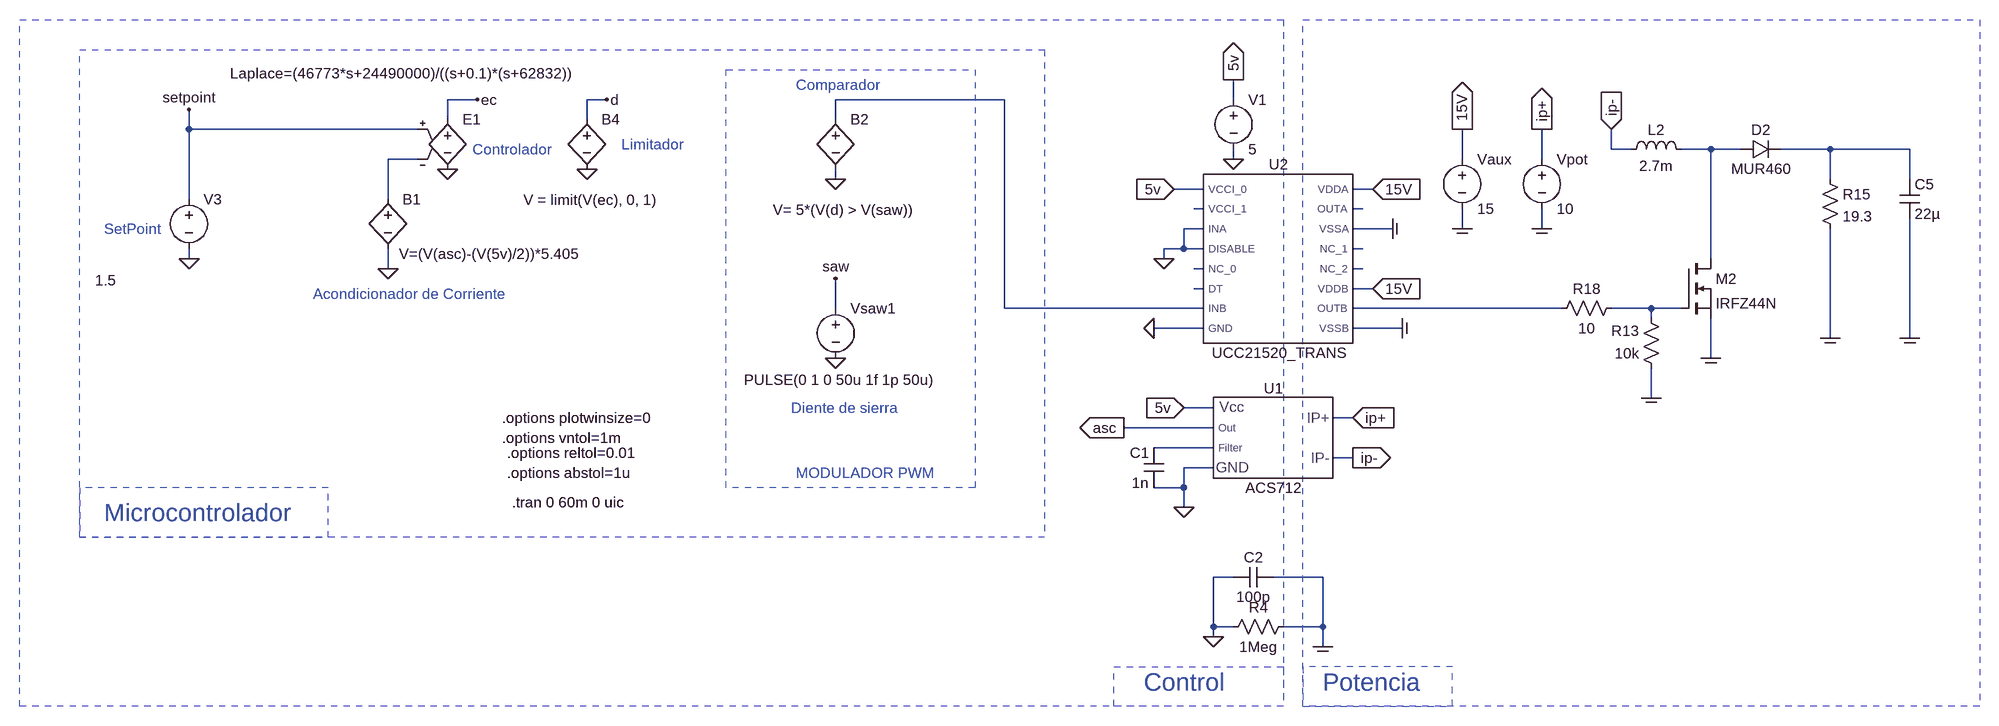
[diagram p0: schematic Boost.asc]
Boost.asc, the LTspice schematic file:
Version 4.1
SHEET 1 2132 1684
WIRE -448 544 -496 544
WIRE -240 544 -272 544
WIRE 400 544 128 544
WIRE 768 544 768 512
WIRE -496 576 -496 544
WIRE -272 576 -272 544
WIRE 128 576 128 544
WIRE -912 592 -912 560
WIRE -544 592 -912 592
WIRE 1376 624 1376 592
WIRE 1408 624 1376 624
WIRE 1536 624 1488 624
WIRE 1584 624 1536 624
WIRE 1728 624 1648 624
WIRE 1856 624 1728 624
WIRE -544 640 -592 640
WIRE 768 640 768 624
WIRE 1136 640 1136 592
WIRE 1264 640 1264 592
WIRE 128 672 128 656
WIRE 1728 672 1728 624
WIRE 1856 672 1856 624
WIRE 720 688 672 688
WIRE 992 688 960 688
WIRE -912 704 -912 592
WIRE -592 704 -592 640
WIRE 720 720 704 720
WIRE 976 720 960 720
WIRE 720 752 688 752
WIRE 1024 752 960 752
WIRE 1136 752 1136 720
WIRE 1264 752 1264 720
WIRE 688 784 688 752
WIRE 688 784 656 784
WIRE 720 784 688 784
WIRE 976 784 960 784
WIRE -912 800 -912 784
WIRE 656 800 656 784
WIRE 1536 800 1536 624
WIRE -592 816 -592 784
WIRE 720 816 704 816
WIRE 976 816 960 816
WIRE 720 848 704 848
WIRE 992 848 960 848
WIRE 128 880 128 832
WIRE 400 880 400 544
WIRE 720 880 400 880
WIRE 1296 880 960 880
WIRE 1440 880 1376 880
WIRE 1488 880 1440 880
WIRE 1440 896 1440 880
WIRE 720 912 640 912
WIRE 1040 912 960 912
WIRE 1728 928 1728 752
WIRE 1856 928 1856 736
WIRE 1536 960 1536 896
WIRE 1440 1024 1440 976
WIRE 736 1040 688 1040
WIRE 960 1056 928 1056
WIRE 736 1072 592 1072
WIRE 736 1104 640 1104
WIRE 960 1120 928 1120
WIRE 736 1136 688 1136
WIRE 688 1168 688 1136
WIRE 688 1168 640 1168
WIRE 688 1200 688 1168
WIRE 768 1312 736 1312
WIRE 912 1312 832 1312
WIRE 736 1392 736 1312
WIRE 768 1392 736 1392
WIRE 912 1392 912 1312
WIRE 912 1392 848 1392
WIRE 736 1408 736 1392
WIRE 912 1424 912 1392
FLAG 768 640 0
FLAG 768 512 5v
IOPIN 768 512 Out
FLAG 1136 592 15V
IOPIN 1136 592 Out
FLAG 1136 752 COM
FLAG 736 1408 0
FLAG 672 688 5v
IOPIN 672 688 In
FLAG 992 688 15V
IOPIN 992 688 In
FLAG 1024 752 COM
FLAG 1040 912 COM
FLAG 1440 1024 COM
FLAG 1536 960 COM
FLAG 1728 928 COM
FLAG 1856 928 COM
FLAG 1264 752 COM
FLAG 640 912 0
FLAG 1264 592 ip+
IOPIN 1264 592 Out
FLAG 960 1056 ip+
IOPIN 960 1056 In
FLAG 960 1120 ip-
IOPIN 960 1120 Out
FLAG 1376 592 ip-
IOPIN 1376 592 In
FLAG 688 1200 0
FLAG 992 848 15V
IOPIN 992 848 In
FLAG 656 800 0
FLAG 688 1040 5v
IOPIN 688 1040 In
FLAG 592 1072 asc
IOPIN 592 1072 Out
FLAG 128 960 0
FLAG 128 832 saw
FLAG -592 816 0
FLAG -912 800 0
FLAG -496 656 0
FLAG -240 544 d
FLAG -272 656 0
FLAG -448 544 ec
FLAG 128 672 0
FLAG 912 1424 COM
FLAG -912 560 setpoint
SYMBOL voltage 768 528 R0
SYMATTR InstName V1
SYMATTR Value 5
SYMBOL voltage 1136 624 R0
WINDOW 123 0 0 Left 0
WINDOW 39 0 0 Left 0
SYMATTR InstName Vaux
SYMATTR Value 15
SYMBOL cap 832 1296 R90
WINDOW 0 0 32 VBottom 2
WINDOW 3 32 32 VTop 2
SYMATTR InstName C2
SYMATTR Value 100p
SYMBOL res 864 1376 R90
WINDOW 0 0 56 VBottom 2
WINDOW 3 32 56 VTop 2
SYMATTR InstName R4
SYMATTR Value 1Meg
SYMBOL res 1456 992 R180
WINDOW 0 36 76 Left 2
WINDOW 3 36 40 Left 2
SYMATTR InstName R13
SYMATTR Value 10k
SYMBOL nmos 1488 800 R0
SYMATTR InstName M2
SYMATTR Value IRFZ44N
SYMBOL ind 1392 640 R270
WINDOW 0 32 56 VTop 2
WINDOW 3 5 56 VBottom 2
SYMATTR InstName L2
SYMATTR Value 2.7m
SYMATTR SpiceLine Rser=1m
SYMBOL voltage 1264 624 R0
WINDOW 123 0 0 Left 0
WINDOW 39 0 0 Left 0
SYMATTR InstName Vpot
SYMATTR Value 10
SYMBOL diode 1584 640 R270
WINDOW 0 32 32 VTop 2
WINDOW 3 0 32 VBottom 2
SYMATTR InstName D2
SYMATTR Value MUR460
SYMBOL res 1712 656 R0
SYMATTR InstName R15
SYMATTR Value 19.3
SYMBOL cap 1840 672 R0
SYMATTR InstName C5
SYMATTR Value 22µ
SYMBOL res 1392 864 R90
WINDOW 0 0 56 VBottom 2
WINDOW 3 32 56 VTop 2
SYMATTR InstName R18
SYMATTR Value 10
SYMBOL ACS712 832 1088 M0
SYMATTR InstName U1
SYMBOL cap 656 1104 M0
SYMATTR InstName C1
SYMATTR Value 1n
SYMBOL bv -592 688 R0
WINDOW 3 18 104 Left 2
SYMATTR Value V=(V(asc)-(V(5v)/2))*5.405
SYMATTR InstName B1
SYMBOL voltage 128 864 R0
WINDOW 3 -147 131 Left 2
WINDOW 123 0 0 Left 0
WINDOW 39 0 0 Left 0
SYMATTR Value PULSE(0 1 0 50u 1f 1p 50u)
SYMATTR InstName Vsaw1
SYMBOL bv 128 560 R0
WINDOW 3 -101 161 Left 2
SYMATTR Value V= 5*(V(d) > V(saw))
SYMATTR InstName B2
SYMBOL voltage -912 688 R0
WINDOW 3 -151 147 Left 2
WINDOW 123 24 124 Left 2
WINDOW 39 0 0 Left 0
SYMATTR Value 1.5
SYMATTR InstName V3
SYMBOL e -496 560 R0
WINDOW 3 -350 -58 Left 2
SYMATTR Value Laplace=(46773*s+24490000)/((s+0.1)*(s+62832))
SYMATTR InstName E1
SYMBOL bv -272 560 R0
WINDOW 3 -102 145 Left 2
SYMATTR Value V = limit(V(ec), 0, 1)
SYMATTR InstName B4
SYMBOL UCC21520_TRANS 832 800 R0
SYMATTR InstName U2
TEXT -392 1192 Left 2 !.tran 0 60m 0 uic
TEXT -400 1112 Left 2 !.options reltol=0.01
TEXT -400 1144 Left 2 !.options abstol=1u
TEXT -408 1088 Left 2 !.options vntol=1m
TEXT -408 1056 Left 2 !.options plotwinsize=0
TEXT 64 520 Left 2 ;Comparador
TEXT 56 1040 Left 2 ;Diente de sierra
TEXT -712 856 Left 2 ;Acondicionador de Corriente
TEXT -456 624 Left 2 ;Controlador
TEXT -216 616 Left 2 ;Limitador
TEXT 64 1144 Left 2 ;MODULADOR PWM
TEXT -1048 1208 Left 4 ;Microcontrolador
TEXT -1048 752 Left 2 ;SetPoint
TEXT 912 1480 Left 4 ;Potencia
TEXT 624 1480 Left 4 ;Control
RECTANGLE Normal 464 1248 -1088 464 2
RECTANGLE Normal -688 1168 -1088 1248 2
RECTANGLE Normal 848 1520 -1184 416 2
RECTANGLE Normal 1968 1520 880 416 2
RECTANGLE Normal 576 1456 848 1520 2
RECTANGLE Normal 1120 1456 880 1520 2
RECTANGLE Normal 352 1168 -48 496 2

The netlist it stands for:
* Boost.asc
V1 5v 0 5
Vaux 15V COM 15
C2 COM 0 100p
R4 COM 0 1Meg
R13 COM N012 10k
M2 N002 N012 COM COM IRFZ44N
L2 ip- N002 2.7m Rser=1m
Vpot ip+ COM 10
D2 N002 N003 MUR460
R15 N003 COM 19.3
C5 N003 COM 22µ
R18 N012 N011 10
X§U1 ip+ ip- N013 asc 5v 0 ACS712  ; pins I+ I- Filter Out V+ V-
C1 N013 0 1n
B1 N004 0 V=(V(asc)-(V(5v)/2))*5.405
Vsaw1 saw 0 PULSE(0 1 0 50u 1f 1p 50u)
B2 N001 0 V= 5*(V(d) > V(saw))
V3 setpoint 0 1.5
E1 ec 0 setpoint N004 Laplace=(46773*s+24490000)/((s+0.1)*(s+62832))
B4 d 0 V = limit(V(ec), 0, 1)
X§U2 0 N010 0 0 N001 N006 N011 5v N005 15V 15V COM COM N008 N007 N009 UCC21520_TRANS  ; pins DISABLE DT GND INA INB OUTA OUTB VCCI_0 VCCI_1 VDDA VDDB VSSA VSSB NC_0 NC_1 NC_2
.model D D
.lib standard.dio
.model NMOS NMOS
.model PMOS PMOS
.lib standard.mos
.tran 0 60m 0 uic
.options reltol=0.01
.options abstol=1u
.options vntol=1m
.options plotwinsize=0
* Comparador
* Diente de sierra
* Acondicionador de Corriente
* Controlador
* Limitador
* MODULADOR PWM
* Microcontrolador
* SetPoint
* Potencia
* Control
.lib ACS712.lib
.lib UCC21520_TRANS.lib
.backanno
.end